# EAGLE schematic dirtypunk (EAGLE 7.5.0)
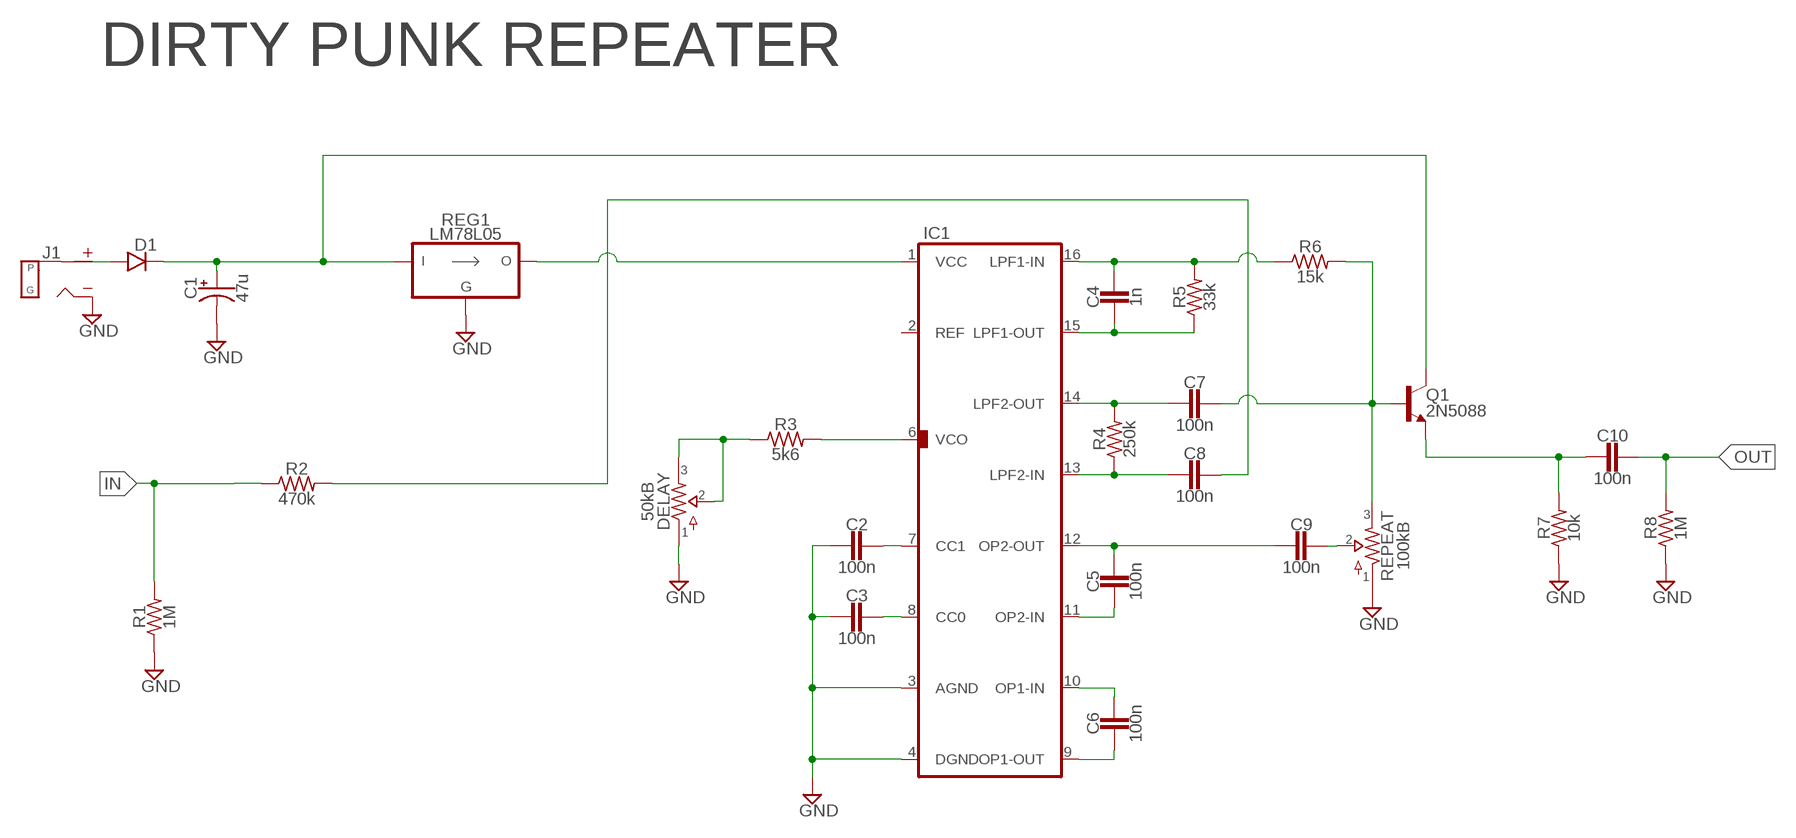
[diagram p0: schematic, sheet 1]

## Parts
C1  47u  0501  [050_020_1]
C2  100n  CER/FILM2  [050X030_025_2]
C3  100n  CER/FILM2  [050X030_025_2]
C4  1n  CER/FILM2  [050X030_025_2]
C5  100n  CER/FILM2  [050X030_025_2]
C6  100n  CER/FILM2  [050X030_025_2]
C7  100n  CER/FILM2  [050X030_025_2]
C8  100n  CER/FILM2  [050X030_025_2]
C9  100n  CER/FILM2  [050X030_025_2]
C10  100n  CER/FILM2  [050X030_025_2]
D1  DO41.3  [DO41-3]
DELAY  50kB  POTSSMALL_PADS  [PADS_SMALL]
IC1  PT2399TH  [DIL16]
J1  DC_MONO  [DC]
Q1  2N5088  [TO92-]
R1  1M  R_.2  [R0207/2V]
R2  470k  R_.2  [R0207/2V]
R3  5k6  R_.2  [R0207/2V]
R4  250k  R_.2  [R0207/2V]
R5  33k  R_.2  [R0207/2V]
R6  15k  R_.2  [R0207/2V]
R7  10k  R_.2  [R0207/2V]
R8  1M  R_.2  [R0207/2V]
REG1  LM78L05  [TO92-]
REPEAT  100kB  POTSSMALL_PADS  [PADS_SMALL]

## Nets
GND: C1.- C2.2 C3.2 DELAY.1 IC1.3(AGND) IC1.4(DGND) J1.S(SLEEVE) R1.1 R7.1 R8.1 REG1.2(GND) REPEAT.1
IN: R1.2 R2.1
N$1: D1.A J1.T(TIP)
N$2: C8.2 IC1.13(LPF2-IN) R4.1
N$3: IC1.1(VCC) REG1.3(VO)
N$4: C7.1 Q1.2(B) R6.2 REPEAT.3
N$5: C4.2 IC1.15(LPF1-OUT) R5.1
N$6: C2.1 IC1.7(CC1)
N$7: C3.1 IC1.8(CC0)
N$8: C7.2 IC1.14(LPF2-OUT) R4.2
N$9: C10.2 Q1.3(E) R7.2
N$12: C6.1 IC1.10(OP1-IN)
N$13: C6.2 IC1.9(OP1-OUT)
N$14: C5.2 IC1.11(OP2-IN)
N$15: C4.1 IC1.16(LPF1-IN) R5.2 R6.1
N$19: C5.1 C9.2 IC1.12(OP2-OUT)
N$21: C9.1 REPEAT.2
N$26: DELAY.2 DELAY.3 R3.1
N$32: C8.1 R2.2
N$33: IC1.6(VCO) R3.2
OUT: C10.1 R8.2
VC: C1.+ D1.C Q1.1(C) REG1.1(VI)
Unconnected: IC1.2(REF)

## Notes on the sheet
- DIRTY PUNK REPEATER

## Library data of the parts
C1 = capacitors-elec:050: 0.22 - 100uF Xicon values at Mouser.com: 10V: 10 - 100uF; 16V: 2.2 - 47uF; 25V: 0.47 - 47uF; 50V: 0.22 - 22uF
C2-C10 = capacitors-film:CER/FILM: 47 - 120pF Xicon Ceramic Disc 2.5mm lead spacing
D1 = diodes:DO41: DO-41 Package Diodes: 1N4001 - 1N40019 Zener Diodes: 1N4728 - 1N4764
DELAY REPEAT = potentiometers:POTS
IC1 = integrated circuits:PT2399: Echo Processor IC
J1 = jacks:DC_MONO
Q1 = transistors:2N5088: NPN Transistor
R1-R8 = resistors:R_
REG1 = regulators:LM78L05